# EasyEDA Pro project Digispark DIY.eprj

# Schematic Schematic1
Board Name: Board1; Create Date: 2025-08-31; Page Name: P1; Project Name: DigisparkDIY; Schematic Name: Schematic1; Update Date: 2025-09-01; Company: m039; Drawn: Dmitry Mozgin; Page Size: A4; Version: V1.0
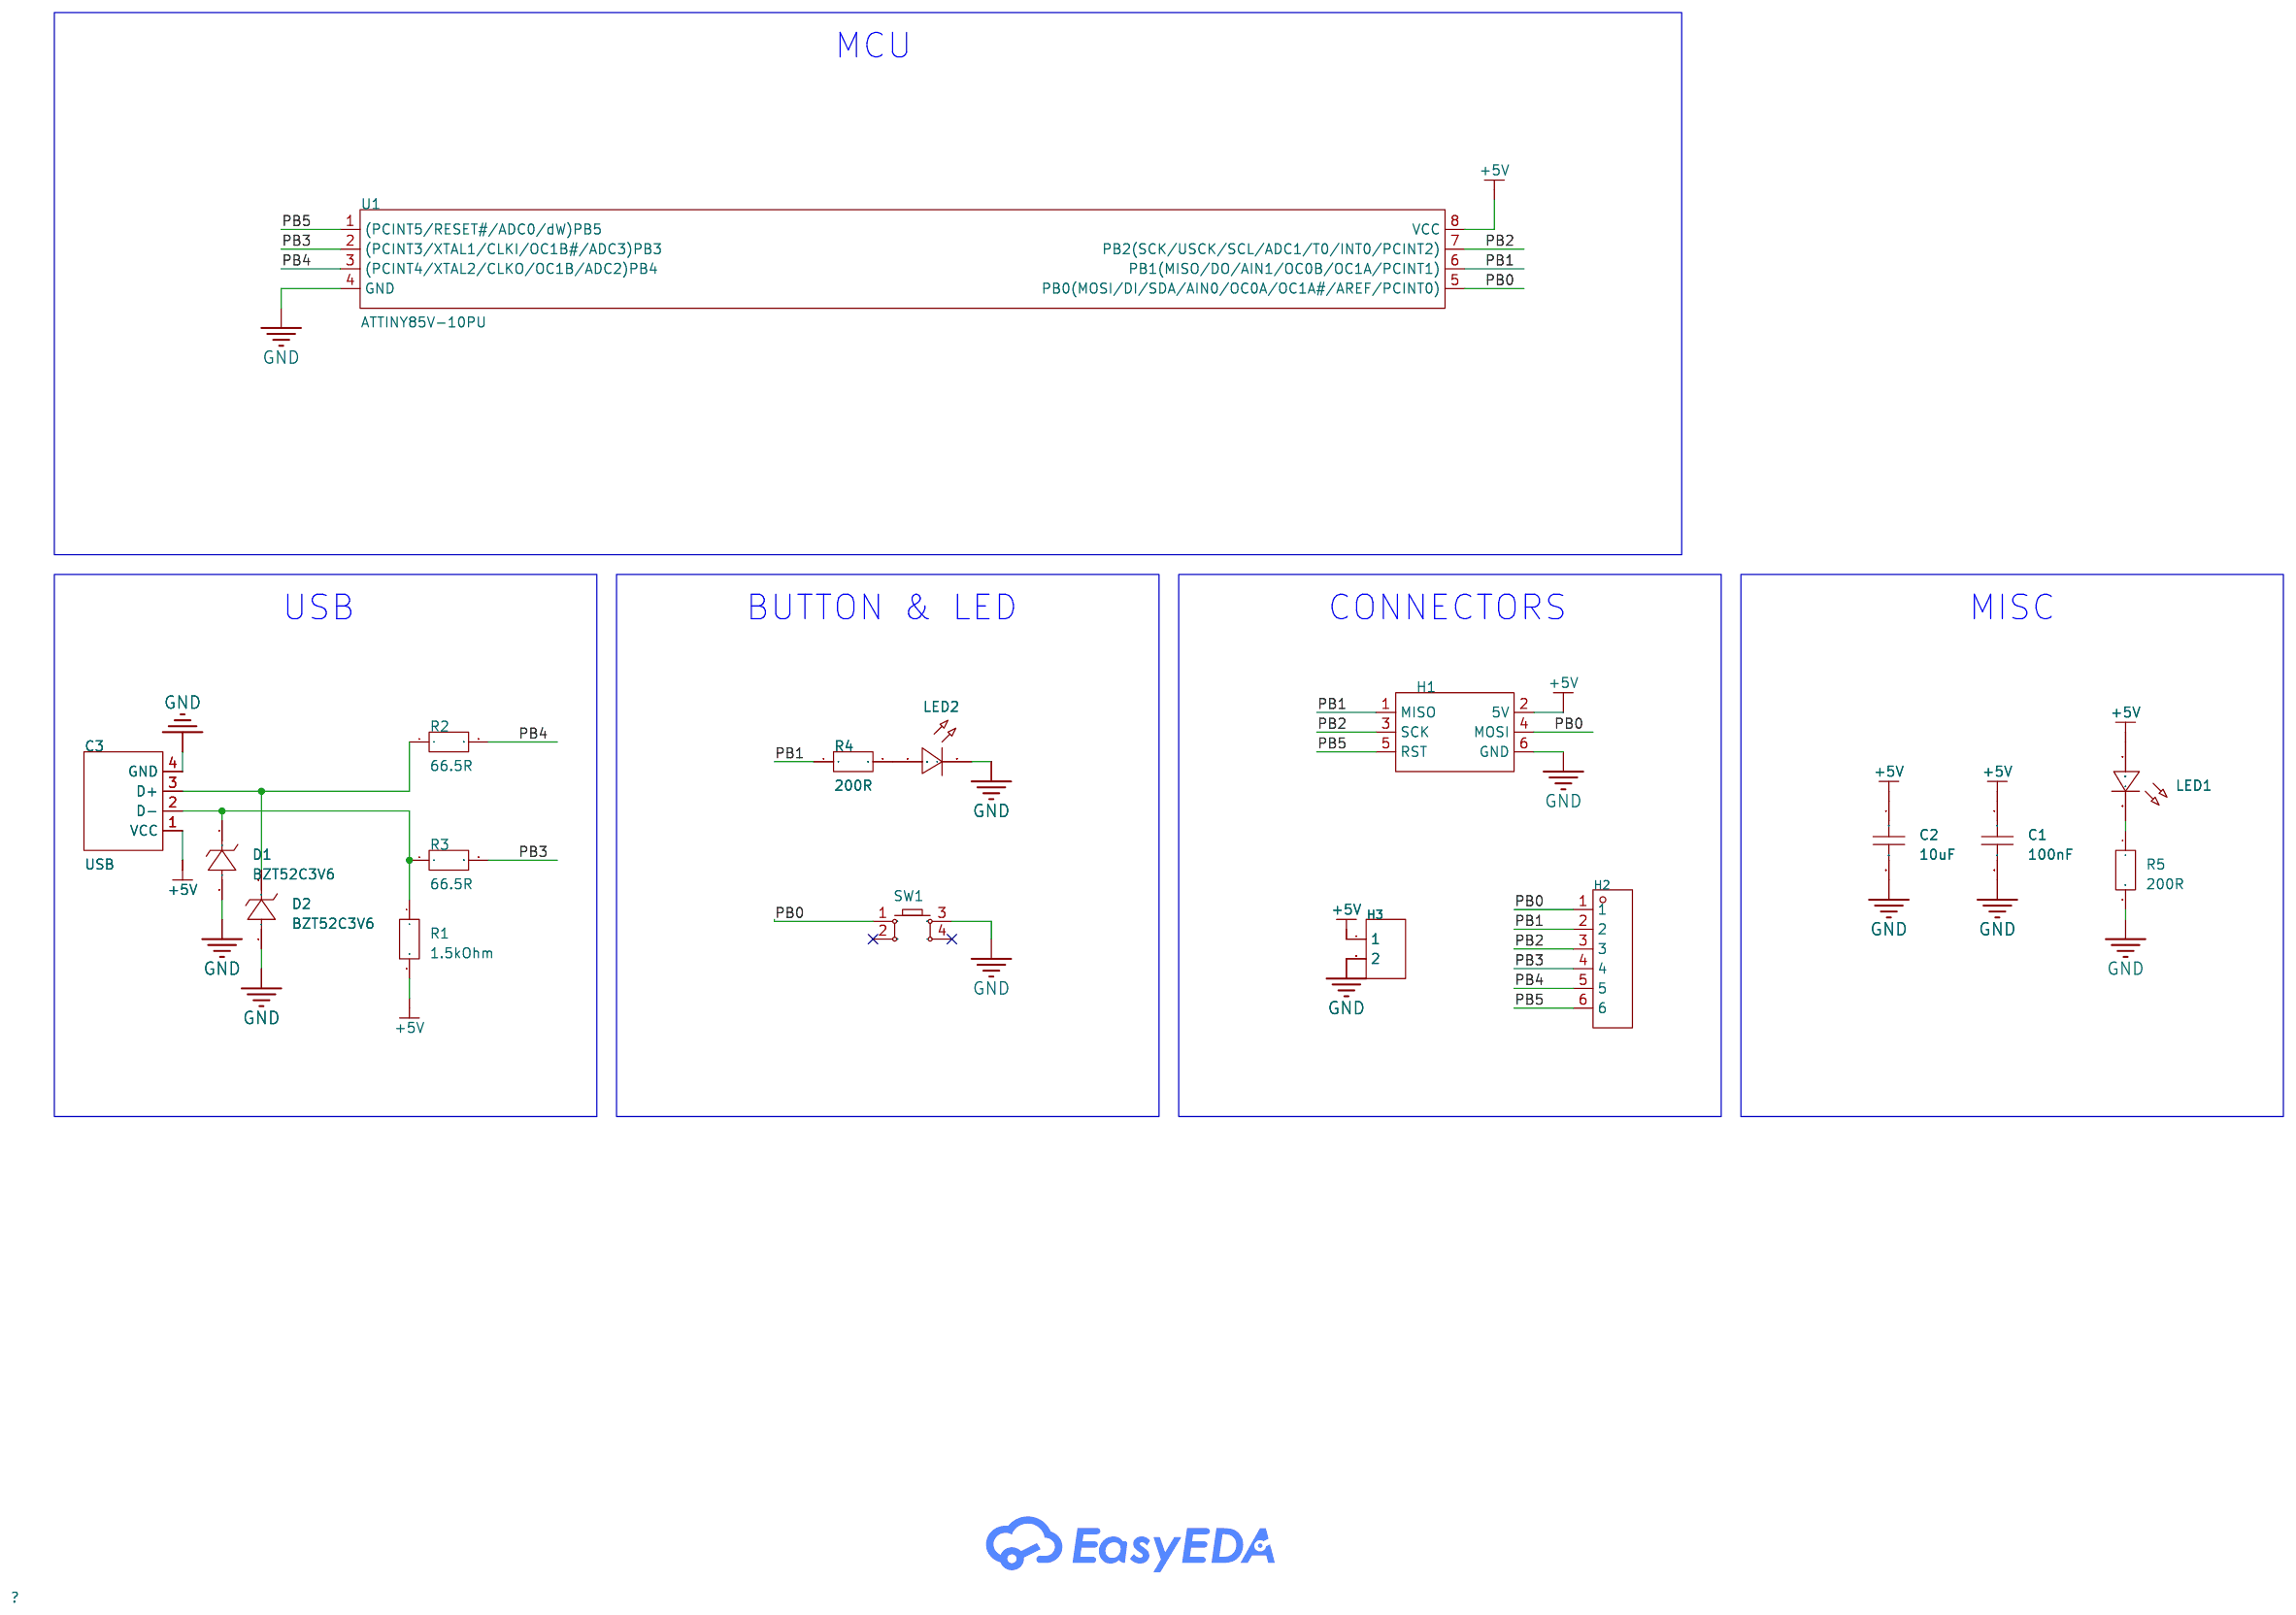
[diagram p0: schematic sheet]

## Parts
C1  100nF  [C0805]
C2  10uF  [C0805]
C3  USB  [USB Type-C 4P]
D1  BZT52C3V6  [SOD-123_L2.7-W1.6-LS3.7-RD-1]
D2  BZT52C3V6  [SOD-123_L2.7-W1.6-LS3.7-RD-1]
H1  -  [AVR ISP 6P]
H2  -  [HDR-TH_6P-P2.54-V-F]
H3  -  [HDR-TH_2P-P2.54-V-F]
LED1  -  [LED-TH_BD3.0-P2.54-FD]
LED2  -  [LED-TH_BD3.8-P2.54-FD_BLUE]
R1  1.5kOhm  [R0805]
R2  66.5R  [R0805]
R3  66.5R  [R0805]
R4  200R  [R0805]
R5  200R  [R0805]
SW1  -  [KEY-TH_4P-L6.0-W6.0-P3.90-LS6.5]
U1  ATTINY85V-10PU  [PDIP-8_L9.6-W6.4-P2.54-LS7.6-BL]

## Library data of the parts
C1 C2 = CAP_0805: Supplier Footprint: 0805
C3 = USB Type-C 4P
D1 D2 = BZT52C3V6: Supplier Part: C908187; Manufacturer: FUXINSEMI(富芯森美); Supplier Footprint: SOD-123; JLCPCB Part Class: Extended Part; Datasheet: https://atta.szlcsc.com/upload/public/pdf/source/20201023/C908183_B6AB4F3470A52C7E154259A13C59963F.pdf; Supplier: LCSC; Diode Configuration: Independent Type; Zener Voltage (Nom): 3.6V; Reverse Leakage Current (Ir): 5uA@1V; Zener Voltage (Range): 3.4V~3.8V; Power Dissipation: 500mW; Zener Impedance (Zzt): 90Ω
H1 = AVR ISP 6P: Supplier Footprint: Through
H2 = HDR-F_2.54_1x6P: Supplier Footprint: Through
H3 = HDR-F_2.54_1x2P: Supplier Footprint: Through
LED1 = LED_TH-R_3mm: Supplier Footprint: Through
LED2 = LED_TH-B_3mm: Supplier Footprint: Through
R1-R5 = Resistor 0805
SW1 = Key_TH_6x6x4.5: Supplier Footprint: Through
U1 = ATTINY85V-10PU_C1339742: Supplier Part: C1339742; Manufacturer: MICROCHIP(美国微芯); Supplier Footprint: PDIP-8; JLCPCB Part Class: Extended Part; Datasheet: https://item.szlcsc.com/datasheet/ATTINY85V-10PU/1430023.html; Supplier: LCSC; CPU Core: AVR; CPU Maximum Speed: 10MHz; Program Storage Size: 8KB; Number of I/O: 6; ADC (Bit): 10bit; Voltage - Supply: 1.8V~5.5V

## Nets
+5V: C1.1 C2.1 C3.1(VCC) H1.2(5V) H3.1 LED1.1(C) R1.2 U1.8(VCC)
GND: C1.2 C2.2 C3.4(GND) D1.2(A) D2.2(A) H1.6(GND) H3.2 LED2.2(A) R5.2 SW1.3 U1.4(GND)
PB0: H1.4(MOSI) H2.1 SW1.1 U1.5(PB0(MOSI/DI/SDA/AIN0/OC0A/OC1A#/AREF/PCINT0))
PB1: H1.1(MISO) H2.2 R4.1 U1.6(PB1(MISO/DO/AIN1/OC0B/OC1A/PCINT1))
PB2: H1.3(SCK) H2.3 U1.7(PB2(SCK/USCK/SCL/ADC1/T0/INT0/PCINT2))
PB3: H2.4 R3.2 U1.2((PCINT3/XTAL1/CLKI/OC1B#/ADC3)PB3)
PB4: H2.5 R2.2 U1.3((PCINT4/XTAL2/CLKO/OC1B/ADC2)PB4)
PB5: H1.5(RST) H2.6 U1.1((PCINT5/RESET#/ADC0/dW)PB5)
$1N1013: C3.2(D-) D1.1(K) R1.1 R3.1
$1N1017: C3.3(D+) D2.1(K) R2.1
$1N1155: LED2.1(C) R4.2
$1N1250: LED1.2(A) R5.1

Not connected (* = marked no-connect by the designer): SW1 2* 4*

## Notes on the sheet
- MCU
- USB
- BUTTON & LED
- CONNECTORS
- MISC

# Board PCB1
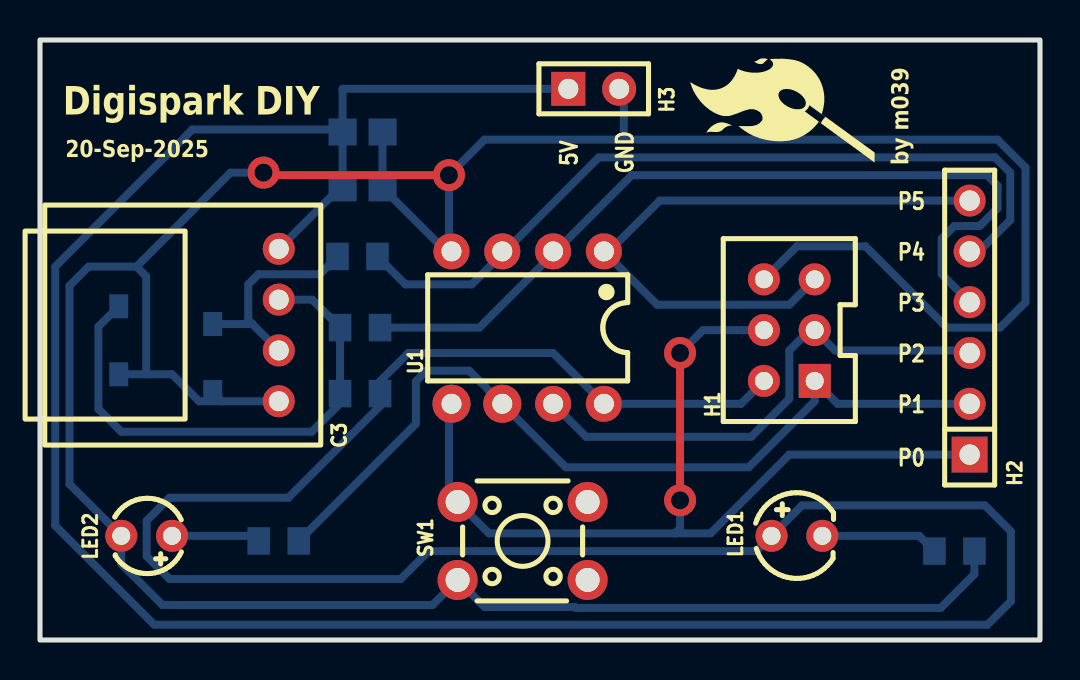
[diagram p1: board, top side]
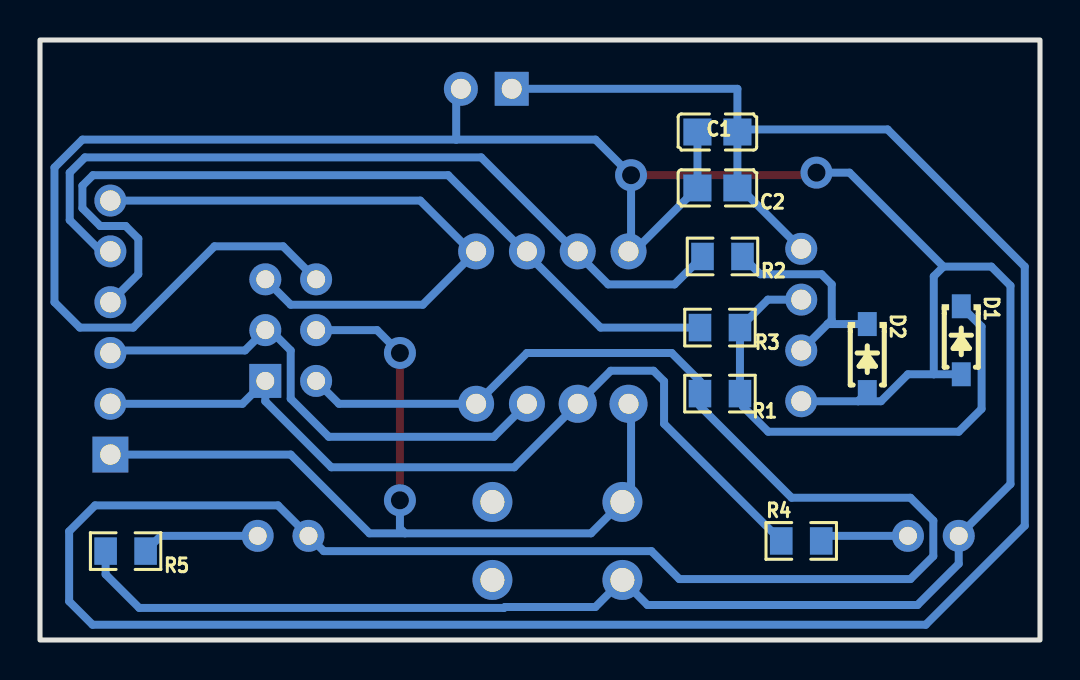
[diagram p2: board, bottom side, seen from below]

Outline 50 x 30 mm; copper layers: Top Layer, Bottom Layer. Coordinates in mm from the lower left corner of the outline.
Outline path: rectangle 0,30 50,0
Stack: Top Layer 0.035mm / Dielectric1 1.51mm FR4 er 4.5 / Bottom Layer 0.035mm

## Design rules (mm)
template: Custom Config
spacing copperThickness1oz (default): track to track 0.2, other pairs 0.152 to 0.3
spacing copperThickness2oz: track to track 0.203, other pairs 0.152 to 0.3
track width copperThickness1oz (default): min 0.127, default 0.4, max 2.54
track width copperThickness2oz: min 0.203, default 0.254, max 2.54
differential pair differentialPair (default): width min 0.127, default 0.254, max 2.54; gap min 0.152, default 0.152
via viaSize (default): diameter min 0.5, default 0.61, max 10; hole min 0.3, default 0.305, max 6.3

## Placement (name value [footprint] x y rotation side)
C1  100nF  [C0805]  16.13 25.4 0 bottom
C2  10uF  [C0805]  16.13 22.61 0 bottom
C3  USB  [USB Type-C 4P]  11.94 15.75 270 top
D1  BZT52C3V6  [SOD-123_L2.7-W1.6-LS3.7-RD-1]  3.94 14.99 270 bottom
D2  BZT52C3V6  [SOD-123_L2.7-W1.6-LS3.7-RD-1]  8.64 14.1 270 bottom
H1  -  [AVR ISP 6P]  37.47 15.49 90 top
H2  -  [HDR-TH_6P-P2.54-V-F]  46.48 15.62 90 top
H3  -  [HDR-TH_2P-P2.54-V-F]  27.69 27.56 0 top
LED1  -  [LED-TH_BD3.0-P2.54-FD]  37.85 5.21 0 top
LED2  -  [LED-TH_BD3.8-P2.54-FD_BLUE]  5.33 5.21 180 top
R1  1.5kOhm  [R0805]  16 12.32 0 bottom
R2  66.5R  [R0805]  15.88 19.18 0 bottom
R3  66.5R  [R0805]  16 15.62 0 bottom
R4  200R  [R0805]  11.94 4.95 180 bottom
R5  200R  [R0805]  45.72 4.44 0 bottom
SW1  -  [KEY-TH_4P-L6.0-W6.0-P3.90-LS6.5]  24.13 4.95 0 top
U1  ATTINY85V-10PU  [PDIP-8_L9.6-W6.4-P2.54-LS7.6-BL]  24.38 15.62 180 top

## Footprints (pads in the part's own frame, mm; a bottom-side part is the same pattern mirrored in y, then rotated)
AVR ISP 6P
  rect 1.7x1.6 hole 0.9: 1(-2.54,-1.27)
  round 1.6 hole 0.9: 2(-2.54,1.27) 3(0,-1.27) 4(0,1.27) 5(2.54,-1.27) 6(2.54,1.27)
C0805
  rect 1.41x1.35 smd: 1(-1,0) 2(1,0)
HDR-TH_2P-P2.54-V-F
  rect 1.7x1.7 hole 1x0.9: 1(-1.27,0)
  round 1.7 hole 1x0.9: 2(1.27,0)
HDR-TH_6P-P2.54-V-F
  rect 1.8x1.8 hole 1.02x0.9: 1(-6.35,0)
  round 1.6 hole 1.02x0.9: 2(-3.81,0) 3(-1.27,0) 4(1.27,0) 5(3.81,0) 6(6.35,0)
KEY-TH_4P-L6.0-W6.0-P3.90-LS6.5
  round 2 hole 1.2x0.9: 1(-3.25,1.95) 2(3.25,1.95) 3(-3.25,-1.95) 4(3.25,-1.95)
LED-TH_BD3.0-P2.54-FD
  round 1.6 hole 0.9: 1(-1.27,0) 2(1.27,0)
LED-TH_BD3.8-P2.54-FD_BLUE
  round 1.6 hole 0.9: 1(-1.27,0) 2(1.27,0)
PDIP-8_L9.6-W6.4-P2.54-LS7.6-BL
  round 1.8 hole 1x0.9: 1(-3.81,-3.81) 2(-1.27,-3.81) 3(1.27,-3.81) 4(3.81,-3.81) 7(-1.27,3.81) 8(-3.81,3.81)
  round 1.905 hole 1x0.9: 5(3.81,3.81) 6(1.27,3.81)
R0805
  rect 1.133x1.377 smd: 1(-1,0) 2(1,0)
SOD-123_L2.7-W1.6-LS3.7-RD-1
  rect 1.2x0.95 smd: 1(-1.7,0) 2(1.7,0)
USB Type-C 4P
  round 1.6 hole 1x0.9: 1(-3.81,0) 2(-1.27,0) 3(1.27,0) 4(3.81,0)

## Nets
As in the schematic.

Pads without a net: SW1 2 4

## Via types
v1: diameter 1.6, hole 0.9, Top Layer to Bottom Layer, 4 vias

## Routing (per net, layer and track width the routed paths; a pad name or vN(x,y) marks a point on that pad's centre or on a via; arc(x,y) is an arc through that point)
+5V: length 188.6
  Bottom Layer w0.4: C3.1 15.13,22.75 15.13,25.15 14.76,25.53 7.62,25.53 0.76,18.67 0.76,5.72 5.72,0.76 47.37,0.76 48.54,1.93 48.54,5.43 47.24,6.73 38.1,6.73 LED1.1 35.81,4.44 19.43,4.44 18.03,3.05 6.48,3.05 5.33,4.19 5.33,5.97 6.48,7.11 12.42,7.11 17,11.7 R1.2 17,12.94 18.41,14.35 25.65,14.35 U1.8 35.05,11.81 H1.2 ; C1.1 15.13,27.56 H3.1
GND: length 164.4
  Top Layer w0.4: v1(20.45,23.24) 11.3,23.24 v1(11.18,23.37)
  Bottom Layer w0.4: C1.2 17.13,25.4 17.13,22.61 C2.2 19.99,19.74 20.45,20.19 ; 5.31,13.29 6.6,13.29 7.95,11.94 9.09,11.94 ; 5.31,13.29 D1.2 ; 5.31,13.29 5.31,18.18 4.83,18.67 ; 29.19,25.02 47.88,25.02 49.28,23.62 49.28,16.89 48.01,15.62 45.34,15.62 41.28,19.69 37.85,19.69 H1.6 ; 29.19,25.02 29.19,27.32 H3.2 ; 29.19,25.02 22.22,25.02 v1(20.45,23.24) 20.45,20.19 ; 20.45,20.19 20.45,19.56 U1.4 ; C3.4 9.09,11.94 ; 9.09,11.94 D2.2 ; 4.83,18.67 9.53,23.37 v1(11.18,23.37) ; 4.83,18.67 2.43,18.67 1.48,17.71 1.48,7.8 LED2.2 4.06,3.81 6.12,1.75 19.63,1.75 SW1.3 22.23,1.65 26.75,1.65 26.8,1.6 45.04,1.6 46.72,3.29 R5.2
PB0: length 46.9
  Top Layer w0.4: v1(32,6.98) v1(32,14.35)
  Bottom Layer w0.4: v1(32,14.35) 33.15,15.49 H1.4 ; H2.1 37.47,9.27 33.53,5.33 31.75,5.33 ; 20.45,11.94 20.45,7.34 SW1.1 22.45,5.33 31.75,5.33 ; 31.75,5.33 32,5.59 v1(32,6.98)
PB1: length 43.2
  Bottom Layer w0.4: H2.2 39.88,11.81 H1.1 38.74,11.94 35.43,8.64 26.29,8.64 U1.6 21.46,13.46 19.32,13.46 18.8,12.94 18.8,10.81 R4.1
PB2: length 25.8
  Bottom Layer w0.4: H2.3 46.35,14.48 39.75,14.48 H1.3 38.48,15.49 37.47,14.48 37.47,12.06 35.56,10.16 27.31,10.16 25.53,11.94
PB3: length 42.6
  Bottom Layer w0.4: R3.2 21.97,15.62 29.59,23.24 47.35,23.24 47.88,22.71 47.88,21.59 46.99,20.7 45.72,20.7 45.09,20.07 45.09,18.29 46.48,16.89
PB4: length 40.4
  Bottom Layer w0.4: H2.5 46.72,19.2 48.51,21 48.51,23.37 47.75,24.13 27.94,24.13 21.59,17.78 18.27,17.78 R2.2
PB5: length 31.3
  Bottom Layer w0.4: H1.5 37.47,16.76 30.86,16.76 28.32,19.3 30.99,21.97 46.48,21.97
$1N1013: length 26.1
  Bottom Layer w0.4: D1.1 2.92,15.67 2.92,11.56 4.06,10.41 13.59,10.41 14.86,11.68 14.86,12.32 ; C3.2 13.6,17.02 R3.1 R1.1
$1N1017: length 11
  Bottom Layer w0.4: R2.1 13.99,18.29 10.92,18.29 10.41,17.78 10.41,16 10.62,15.8 ; 10.62,15.8 C3.3 ; 10.62,15.8 D2.1
$1N1155: length 4.4
  Bottom Layer w0.4: LED2.1 10.68,5.21 R4.2
$1N1250: length 5.9
  Bottom Layer w0.4: R5.1 43.96,5.21 LED1.2

## Text on the board
Top Silkscreen Layer: 5V | GND | P5 | P4 | P3 | P2 | P1 | P0 | by m039 | 20-Sep-2025 | Digispark DIY
